# EAGLE design Core-ProMini (EAGLE 7.7.0)
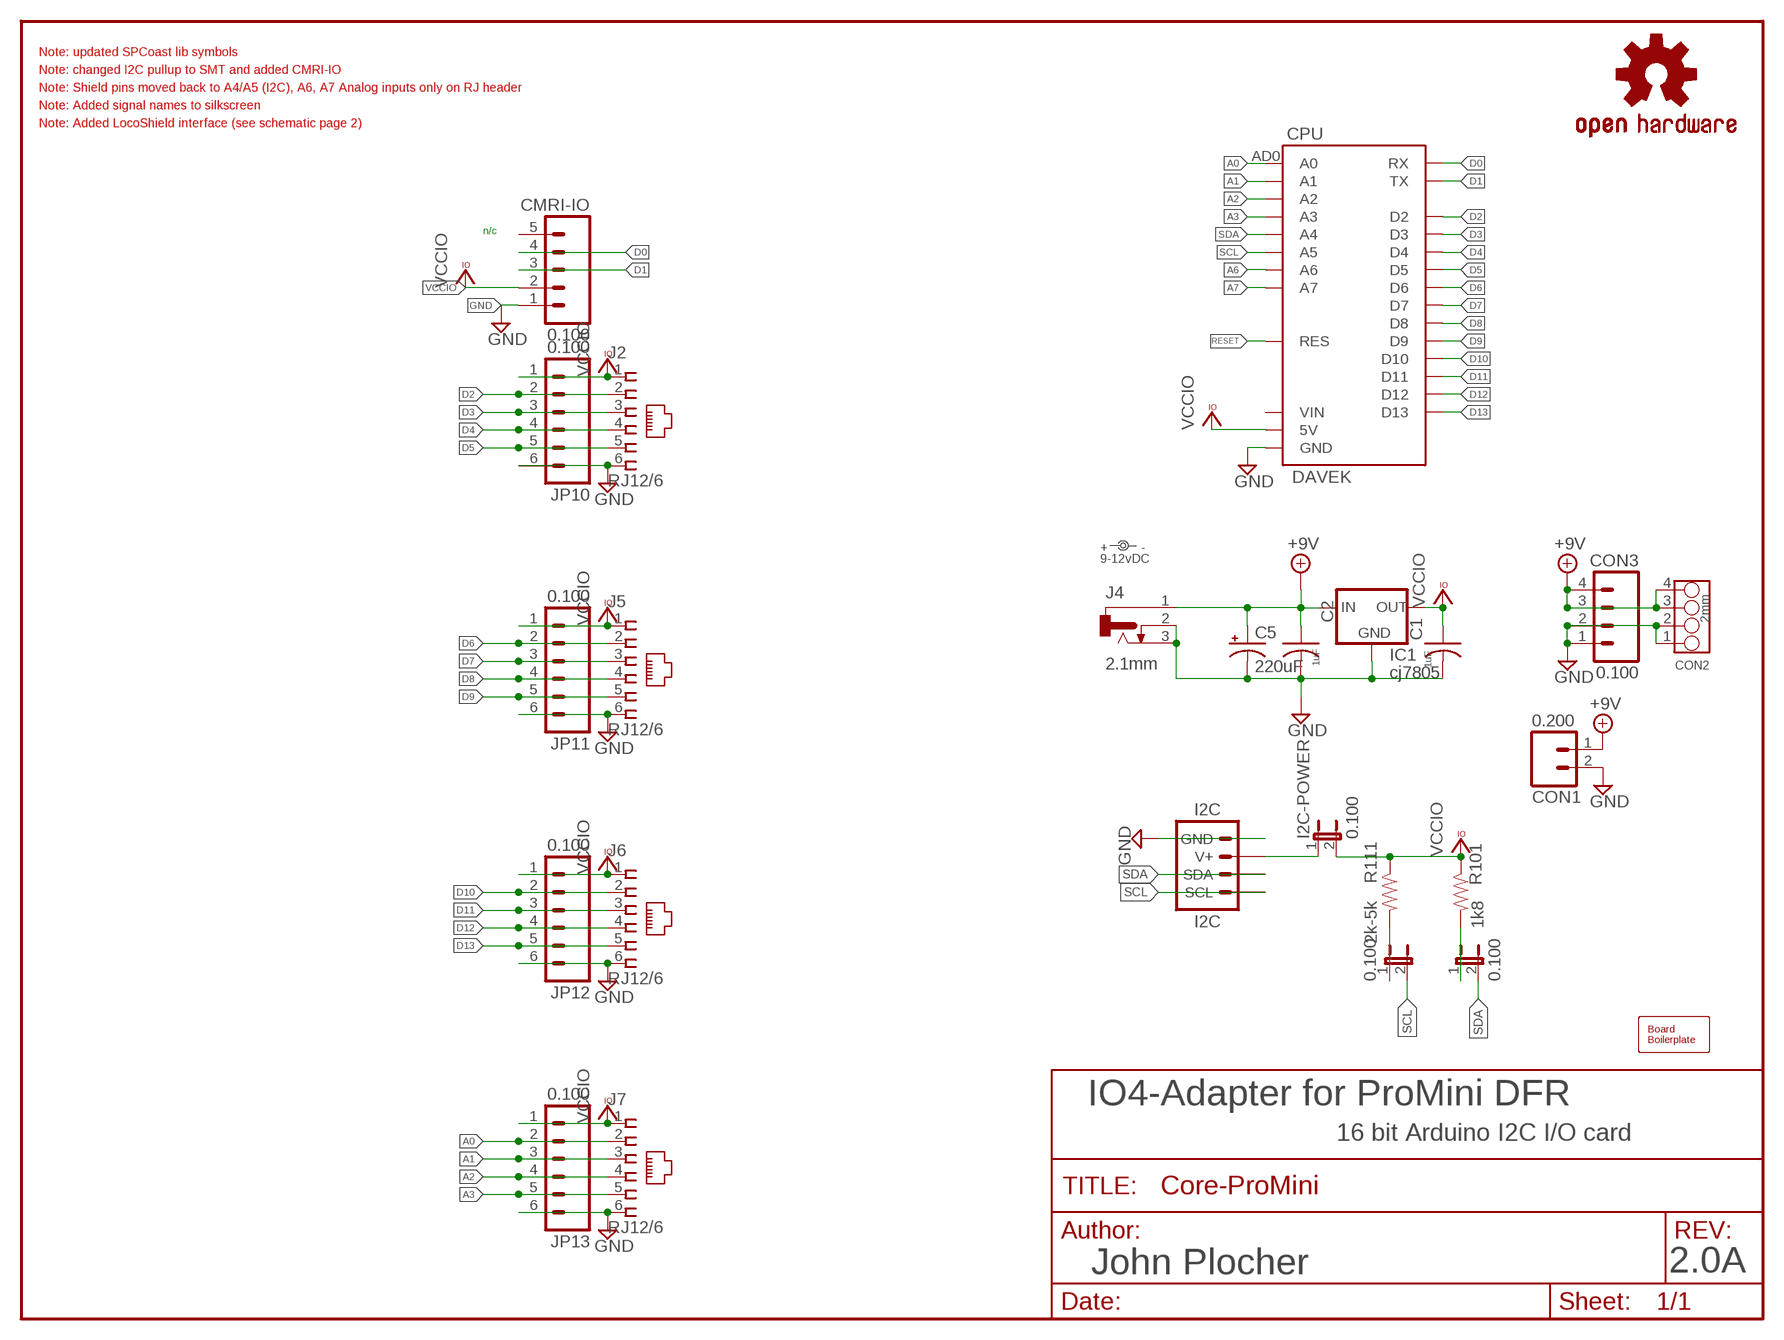
[diagram p0: schematic, sheet 1]

## Parts
BOARD  BOARD  BOARD80X100  [BOARD-DINRAIL-3.17INX10CM]
C1  1uF  CAP0603  [0603-CAP]
C2  1uF  CAP0603  [0603-CAP]
C5  220uF  CAP-POL0810  [0810-CAP]
CMRI-IO  0.100  CONNECTOR-M05CMRI  [1X05-CMRI-IO]
CON1  0.200  CONNECTOR-M02508-LOCK  [MSTB2]
CON2  2mm  CONNECTOR-GROVE-4P-2.0-3470130P1  [4P-2.0]
CON3  0.100  CONNECTOR-M04LOCK  [1X04_LOCK]
CPU  DAVEK  ARDUINO-PRO-MINIDAVESROBOT  [ARDUINO_PRO_MINI_DAVEK]
I2C  I2C  CONNECTOR-I2CLEFT  [I2C-L]
I2C-POWER  0.100  JUMPER-2PTH_LOCK  [1X02_LOCK]
IC1  cj7805  VREG-DPAK-5  [TO-252]
J2  RJ12/6  CONNECTOR-RJ25-6P6C  [RJ25-PANEL]
J4  2.1mm  CONNECTOR-DC-POWER-RA  [DCJ0202]
J5  RJ12/6  CONNECTOR-RJ25-6P6C  [RJ25-PANEL]
J6  RJ12/6  CONNECTOR-RJ25-6P6C  [RJ25-PANEL]
J7  RJ12/6  CONNECTOR-RJ25-6P6C  [RJ25-PANEL]
JP10  0.100  CONNECTOR-M06LOCK  [1X06_LOCK]
JP11  0.100  CONNECTOR-M06LOCK  [1X06_LOCK]
JP12  0.100  CONNECTOR-M06LOCK  [1X06_LOCK]
JP13  0.100  CONNECTOR-M06LOCK  [1X06_LOCK]
OSH  OSHW  OSHW-LOGOL  [OSHW-LOGO-L]
PWR  9-12vDC  DOC-POWER_LABEL  [PWR_LABEL]
R101  1k8  R0603-RES  [0603-RES]
R111  2k-5k  R0603-RES  [0603-RES]
SCL  0.100  JUMPER-2PTH_LOCK  [1X02_LOCK]
SDA  0.100  JUMPER-2PTH_LOCK  [1X02_LOCK]

## Nets
+9V [Power]: C2.1 C5.+ CON1.1(A) CON2.3 CON2.4 CON3.3 CON3.4 IC1.1(IN) J4.1
A0 [signals]: CPU.AD0(A0) J7.2 JP13.2
A1 [signals]: CPU.AD1(A1) J7.3 JP13.3
A2 [signals]: CPU.AD2(A2) J7.4 JP13.4
A3 [signals]: CPU.AD3(A3) J7.5 JP13.5
A6: CPU.AD6(A6)
A7: CPU.AD7(A7)
D0 [signals]: CMRI-IO.4 CPU.RX
D1 [signals]: CMRI-IO.3 CPU.TX@1(TX)
D2: CPU.D2 J2.2 JP10.2
D3: CPU.D3 J2.3 JP10.3
D4: CPU.D4 J2.4 JP10.4
D5 [signals]: CPU.D5 J2.5 JP10.5
D6 [signals]: CPU.D6 J5.2 JP11.2
D7: CPU.D7 J5.3 JP11.3
D8: CPU.D8 J5.4 JP11.4
D9 [signals]: CPU.D9 J5.5 JP11.5
D10 [signals]: CPU.D10 J6.2 JP12.2
D11 [signals]: CPU.D11 J6.3 JP12.3
D12 [signals]: CPU.D12 J6.4 JP12.4
D13 [signals]: CPU.D13 J6.5 JP12.5
GND [Power]: C1.2 C2.2 C5.- CMRI-IO.1 CON1.2(B) CON2.1 CON2.2 CON3.1 CON3.2 CPU.GND@1(GND) CPU.GND@2(GND) CPU.GND@4(GND) I2C.GND I2C.GND@1(GND) IC1.2(GND) J2.6 J4.2 J4.3 J5.6 J6.6 J7.6 JP10.6 JP11.6 JP12.6 JP13.6
N$2: R111.2 SCL.1
N$3: R101.2 SDA.1
N$44: I2C-POWER.1 I2C.V+ I2C.V+@1(V+)
RESET: CPU.RES CPU.RES@1(RES)
SCL: CPU.AD5(A5) I2C.SCL I2C.SCL@1(SCL) SCL.2
SDA: CPU.AD4(A4) I2C.SDA I2C.SDA@1(SDA) SDA.2
VCCIO: C1.1 CMRI-IO.2 CPU.5V I2C-POWER.2 IC1.3(OUT) J2.1 J5.1 J6.1 J7.1 JP10.1 JP11.1 JP12.1 JP13.1 R101.1 R111.1
Unconnected: CMRI-IO.5 CPU.VIN

## Notes on the sheet
- Note: updated SPCoast lib symbols
- Note: changed I2C pullup to SMT and added CMRI-IO
- Note: Shield pins moved back to A4/A5 (I2C), A6, A7 Analog inputs only on RJ header
- Note: Added signal names to silkscreen
- Note: Added LocoShield interface (see schematic page 2)
- n/c
- IO4-Adapter for ProMini DFR
- 16 bit Arduino I2C I/O card
- John Plocher | 2.0A

## Library data of the parts
BOARD = SPCoast:BOARD
C1 C2 = SPCoast:CAP*
C5 = SPCoast:CAP-POL*
CMRI-IO = SPCoast:CONNECTOR-M05: Header 5 Standard 5-pin 0.1" header. Use with straight break away headers (SKU : PRT-00116), right angle break away headers (PRT-00553), swiss pins (PRT-00743), machine pins (PRT-00117), and female headers (PRT-00115). Molex polarized connector foot print use with SKU : PRT-08230 with associated crimp pins and housings.
CON1 = SPCoast:CONNECTOR-M02: PHOENIX CONNECTOR
CON2 = SPCoast:CONNECTOR-GROVE-4P-2.0
CON3 = SPCoast:CONNECTOR-M04: Header 4 Standard 4-pin 0.1" header. Use with straight break away headers (SKU : PRT-00116), right angle break away headers (PRT-00553), swiss pins (PRT-00743), machine pins (PRT-00117), and female headers (PRT-00115). Molex polarized connector foot print use with SKU : PRT-08231 with associated crimp pins and housings. 1MM SMD Version SKU: PRT-10208
CPU = SPCoast:ARDUINO-PRO-MINI
I2C = SPCoast:CONNECTOR-I2C
I2C-POWER SCL SDA = SPCoast:JUMPER-2: Jumper Basic 0.1" spaced jumper. Use with breakaway headers.
IC1 = SPCoast:VREG-?-*: Voltage Regulator Standard linear regulator. 7805 uses IGO pinout LM1117 uses GOI pinout
J2 J5-J7 = SPCoast:CONNECTOR-RJ25: AMP connector; AMP: 520250-3; OPL: none
J4 = SPCoast:CONNECTOR-DC-POWER: DC POWER JACK
JP10-JP13 = SPCoast:CONNECTOR-M06: Header 6 Standard 6-pin 0.1" header
OSH = SparkFun:OSHW-LOGO: Open Source Hardware Logo This logo indicates the piece of hardware it is found on incorporates a OSHW license and/or adheres to the definition of open source hardware found here: http://freedomdefined.org/OSHW
PWR = SPCoast:DOC-POWER_LABEL
R101 R111 = SPCoast:R*: Resistor Basic schematic elements and footprints for 0603, 1206, and PTH 1/10th watt (small) resistors.

## Net classes
0 default: width 0.203 mm, drill 0.5 mm
1 Power: width 0.406 mm, drill 0.8 mm
2 signals: width 0.254 mm, drill 0.5 mm

## Board
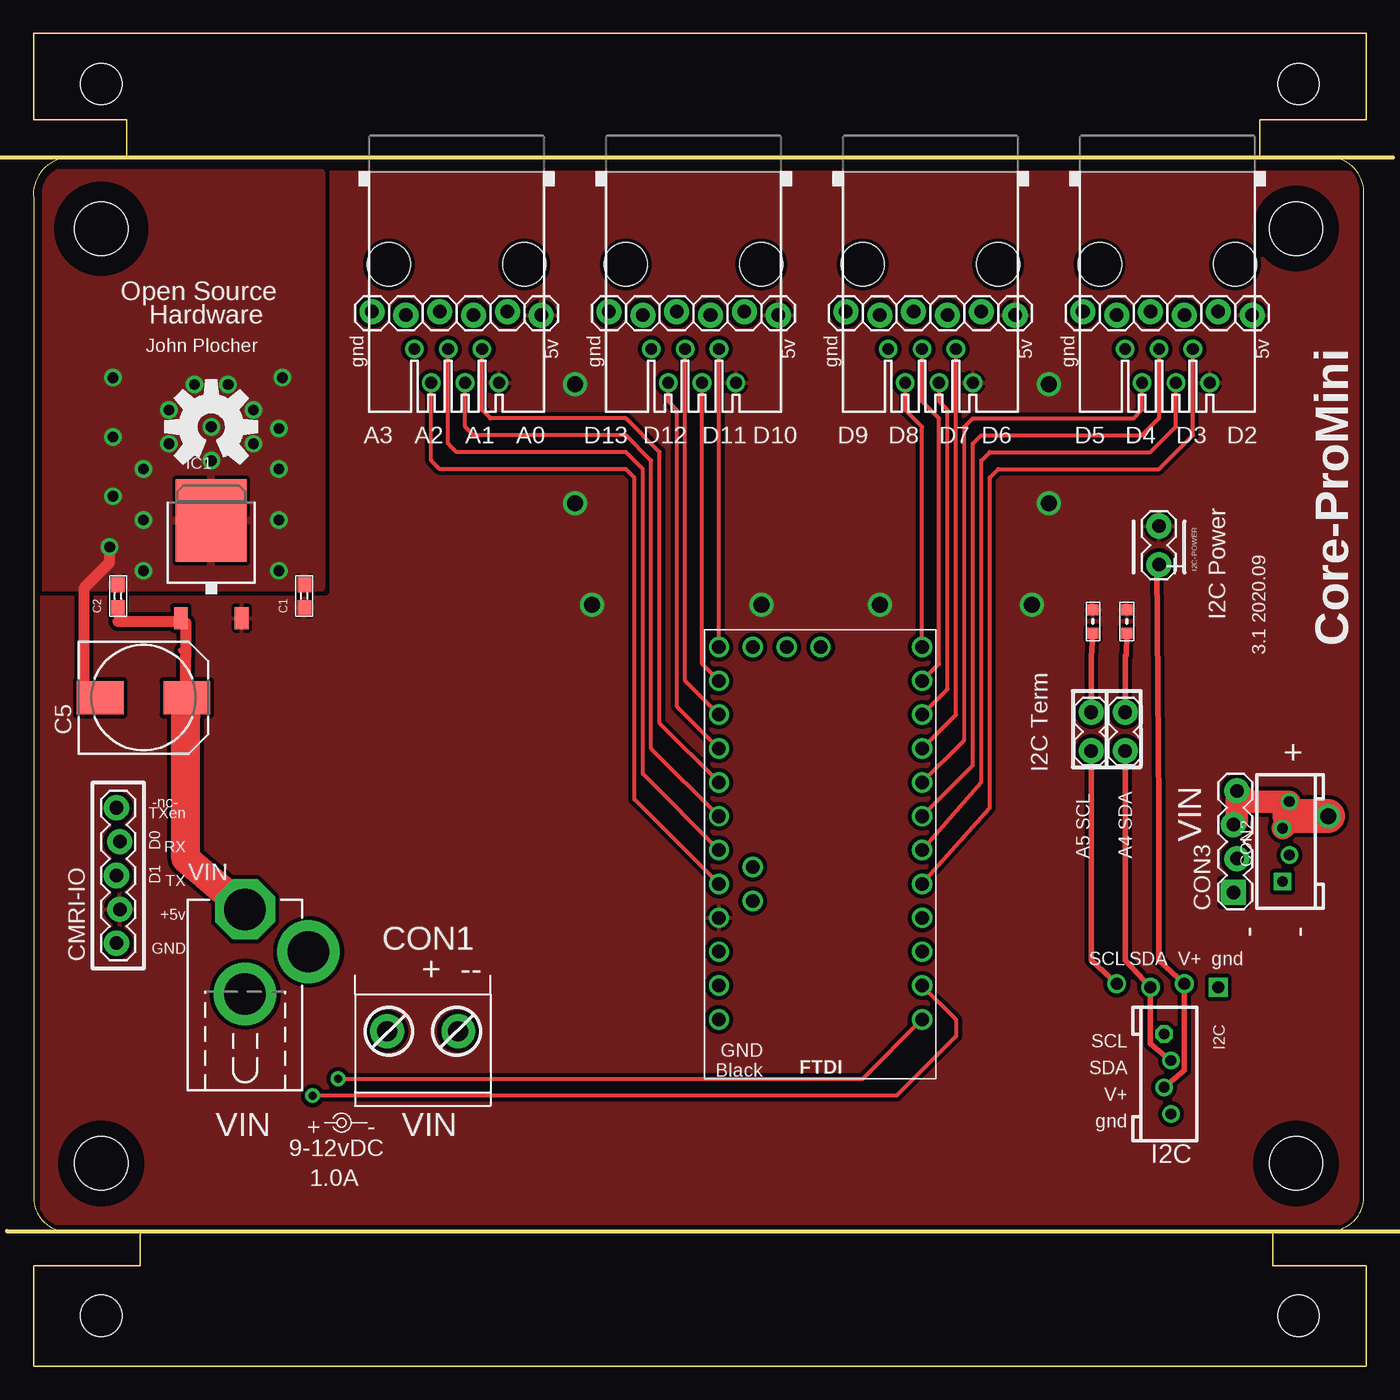
[diagram p1: board, top side]
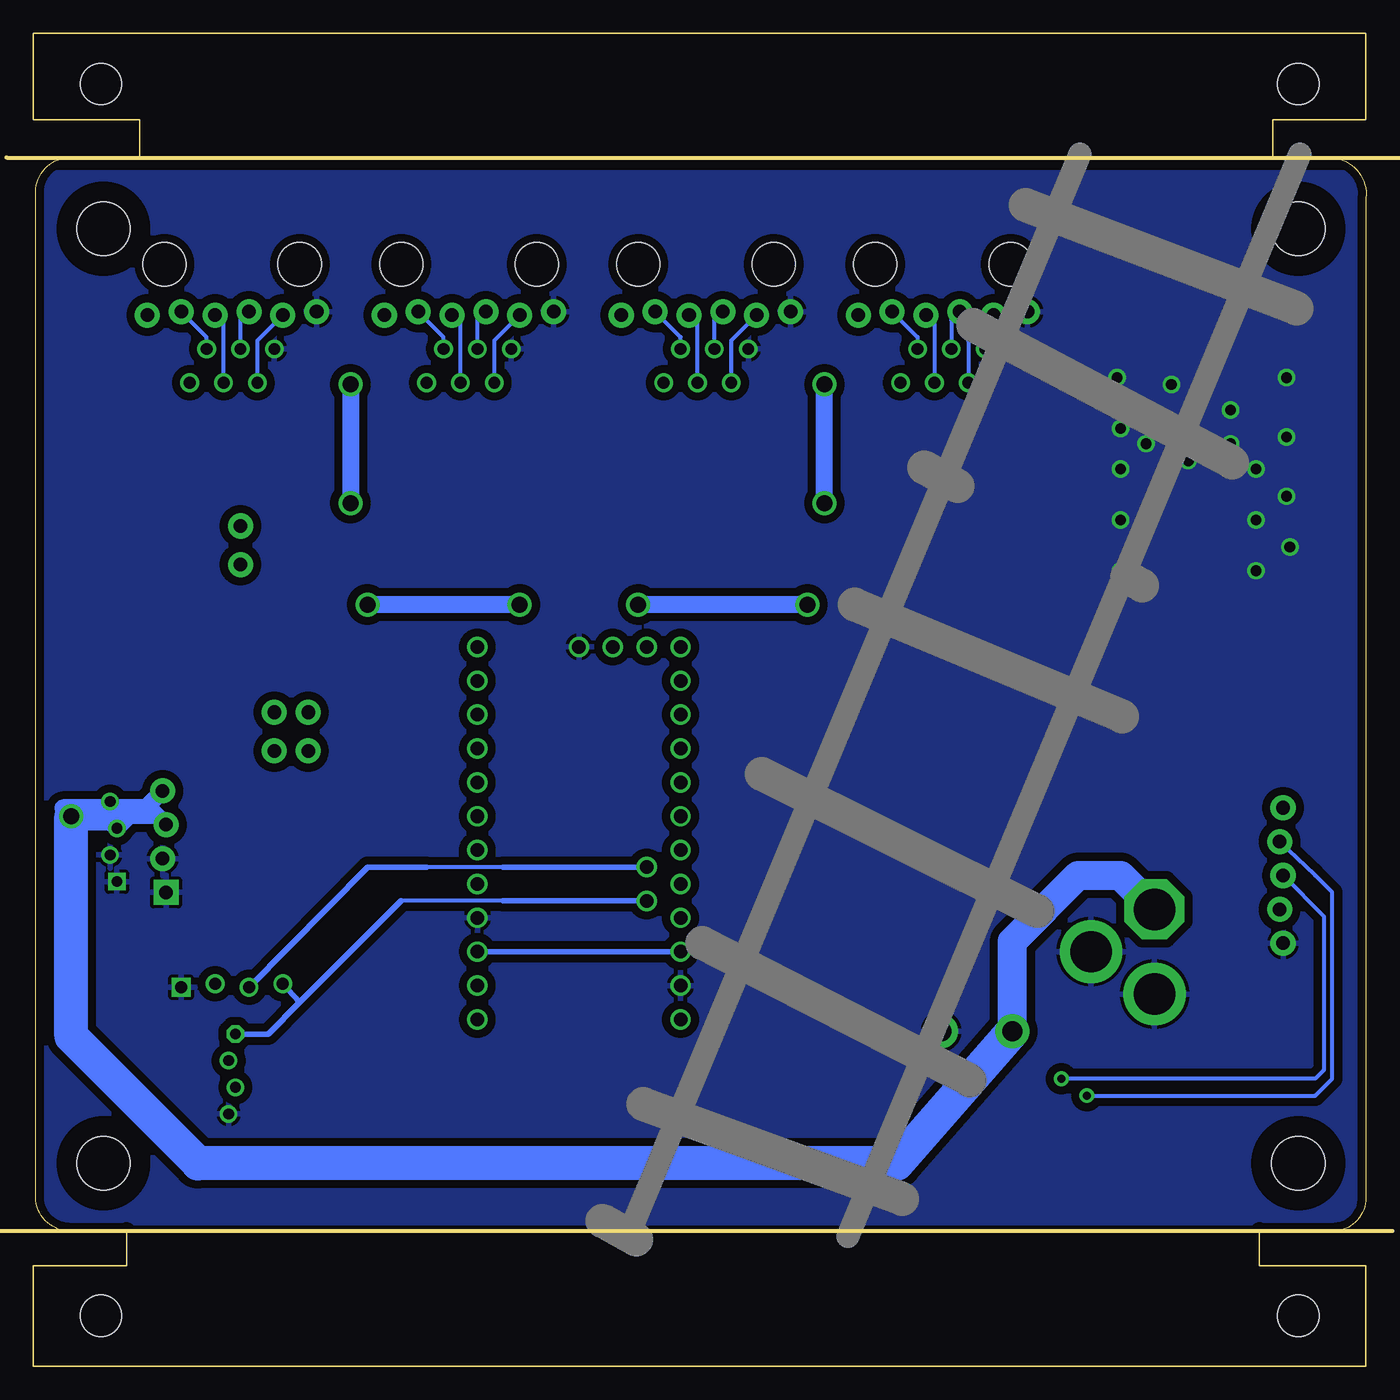
[diagram p2: board, bottom side, seen from below]

Size 100.01 x 100 mm. Coordinates in mm from the lower left corner, seen from the top.
Copper layers (1*16): Top 0.035mm / dielectric 1.5mm / Bottom 0.035mm
Design rules "Fusion_eagle_rule_v1.1 *": minimum track width 8mil, minimum drill 0.6mm, track to track 6mil, track to pad 6mil, pad to pad 10mil, via to via 10mil, smd to smd 10mil, copper to edge 10mil, drill to drill 10mil, minimum pad ring 10mil, minimum via ring 10mil, stop-mask expansion 2mil, vias tented up to drill 100mil, thermal gap 10mil

### Footprints (pad centres in the part's own frame; a part is rotated, then mirrored left to right if it is on the bottom)
BOARD-DINRAIL-3.17INX10CM = hole 4: 94.742,15.24; 5.08,85.344; 94.742,85.344; 5.08,15.24 | hole 3.1: 5.08,96.19; 94.92,96.19; 5.08,3.81; 94.92,3.81
0603-CAP = smd 1.1 x 1: 1 -0.85,0; 2 0.85,0
0810-CAP = smd 3.5 x 2.5: + 3.25,0; - -3.25,0
1X05-CMRI-IO = drill 1.016 pad 1.88: 1 0,0.127; 2 2.54,-0.127; 3 5.08,0.127; 4 7.62,-0.127; 5 10.16,0.127
MSTB2 = drill 1.5 pad 2.54: 1 -2.667,1.016; 2 2.667,1.016
4P-2.0 = drill 0.8 pad 1.27 square: 1 -3,0.254 | drill 0.8 pad 1.27: 2 -1,-0.254; 3 1,0.254; 4 3,-0.254
1X04_LOCK = drill 1.016 pad 1.88 square: 1 0,0.127 | drill 1.016 pad 1.88: 2 2.54,-0.127; 3 5.08,0.127; 4 7.62,-0.127
ARDUINO_PRO_MINI_DAVEK = drill 1.016: 5V 16.51,21.59; AD0 16.51,11.43; AD1 16.51,13.97; AD2 16.51,16.51; AD3 16.51,19.05; AD4 13.97,17.78; AD5 13.97,20.32; AD6 11.43,1.27; AD7 13.97,1.27; D2 1.27,19.05; D3 1.27,16.51; D4 1.27,13.97; D5 1.27,11.43; D6 1.27,8.89; D7 1.27,6.35; D8 1.27,3.81; D9 1.27,1.27; D10 16.51,1.27; D11 16.51,3.81; D12 16.51,6.35; D13 16.51,8.89; GND@1 16.51,26.67; GND@2 8.89,1.27; GND@4 1.27,21.59; RES 16.51,24.13; RES@1 1.27,24.13; RX 1.27,26.67; TX@1 1.27,29.21; VIN 16.51,29.21
I2C-L = drill 0.9 square: GND 3.81,-0.127 | drill 0.8 pad 1.27: GND@1 0.254,-9.635; SDA@1 0.254,-5.635; V+@1 -0.254,-7.635 | drill 0.9: SCL -3.81,0.127; SDA -1.27,-0.127; V+ 1.27,0.127 | drill 0.8 pad 1.27 octagon: SCL@1 -0.254,-3.635
1X02_LOCK = drill 1.016 pad 1.88: 1 -0.178,0; 2 2.718,0
TO-252 = smd 1.651 x 1.016: 1 -4.826,2.286; 3 -4.826,-2.286 | smd 6.2 x 5.3: 2 2.5,0
RJ25-PANEL = drill 0.889: 1 -3.175,8.89; 2 -1.905,6.35; 3 -0.635,8.89; 4 0.635,6.35; 5 1.905,8.89; 6 3.175,6.35 | hole 3.251: -5.08,0; 5.08,0
DCJ0202 = drill 3.1 pad 4.5 octagon: 1 0,3.175 | drill 3.1 pad 4.7: 2 4.763,0; 3 0,-3.175
1X06_LOCK = drill 1.016 pad 1.88: 1 0,0; 2 2.54,-0.254; 3 5.08,0; 4 7.62,-0.254; 5 10.16,0; 6 12.7,-0.254
0603-RES = smd 0.813 x 0.813: 1 -0.889,0; 2 0.889,0

### Placement (x,y rotation side)
BOARD  0.01,0 0 top
C1  20.33,57.78 90 top
C2  6.36,57.78 90 top
C5  8.27,50.16 0 top
CMRI-IO  6.36,31.75 90 top
CON1  29.22,24.13 0 top
CON2  93.99,39.37 90 top
CON3  90.18,35.56 90 top
CPU  67.96,55.24 180 top
I2C  85.1,28.57 0 top
I2C-POWER  84.47,60.33 90 top
IC1  13.35,60.96 90 top
J2  85.1,82.68 180 top
J4  15.89,31.11 0 top
J5  67.32,82.68 180 top
J6  49.54,82.68 180 top
J7  31.76,82.68 180 top
JP10  91.45,78.87 180 top
JP11  73.67,78.87 180 top
JP12  55.89,78.87 180 top
JP13  38.11,78.87 180 top
OSH  13.35,70.48 0 top
PWR  23.13,18.29 90 top
R101  82.06,55.88 270 top
R111  79.52,55.88 270 top
SCL  79.39,48.9 270 top
SDA  81.93,48.9 270 top

### Tracks (layer width: path | path; a pad name or v marks a point on that pad's centre or on a via)
+9V  (via drill 1.2)
  Top 0.406: 11.44,53.34 11.06,53.72 | C5.+ 11.44,48.82
  Top 0.61: IC1.1 10.81,55.88 | 6.36,55.88 C2.1
  Top 0.813: 11.44,48.82 11.44,53.34 11.44,55.75 IC1.1 | 10.81,55.88 6.36,55.88
  Top 1.676: CON3.3 90.31,40.89 CON3.4 91.12,42.37 CON2.4 94.25,41.27 94.25,40.88 CON2.3
  Top 2.184: 11.44,48.82 11.44,38.1 J4.1
  Top 2.54: v97.17,41.27 94.25,41.27
  Bottom 1.27: CON2.4 95.34,41.27 | 94.64,41.27 CON2.3 92.77,41.34 90.76,41.34 | CON3.4 91.58,41.91 97.8,41.91 | CON3.3 90.76,41.34 | 90.76,41.34 91.33,41.91 91.45,41.91
  Bottom 2.184: CON1.1 26.56,31.88 21.6,36.83 18.43,36.83 J4.1 | 95.34,41.27 v97.17,41.27 94.64,41.27
  Bottom 2.54: CON1.1 35.19,15.24 87.64,15.24 97.17,24.77 v97.17,41.27
A0
  Top 0.305: CPU.AD0 47,48.26 47,68.58 44.46,71.12 34.3,71.12 33.67,71.75 J7.2
  Bottom 0.305: JP13.2 33.67,77.22 J7.2
A1
  Top 0.305: CPU.AD1 46.37,46.35 46.37,67.94 44.46,69.85 33.03,69.85 32.4,70.48 J7.3
  Bottom 0.305: JP13.3 32.4,78.23 J7.3
A2
  Top 0.305: CPU.AD2 45.73,44.45 45.73,67.31 44.46,68.58 31.76,68.58 31.13,69.22 J7.4
  Bottom 0.305: JP13.4 31.13,78.49 J7.4
A3
  Top 0.305: CPU.AD3 45.1,42.55 45.1,66.67 44.46,67.31 30.49,67.31 29.86,67.94 J7.5
  Bottom 0.305: JP13.5 29.86,76.96 J7.5
D0  (via drill 0.6)
  Top 0.305: CPU.RX 69.23,26.04 69.23,24.77 64.78,20.32 v20.97,20.32
  Bottom 0.305: v20.97,20.32 3.82,20.32 2.55,21.59 2.55,35.56 3.82,36.83 CMRI-IO.4
D1  (via drill 0.6)
  Top 0.305: v22.87,21.59 62.24,21.59 CPU.TX@1
  Bottom 0.305: CMRI-IO.3 3.19,33.78 3.19,22.23 3.82,21.59 v22.87,21.59
D2
  Top 0.305: CPU.D2 71.77,41.91 71.77,66.67 72.4,67.31 84.47,67.31 87.01,69.85 J2.2
  Bottom 0.305: J2.2 87.01,77.22 JP10.2
D3
  Top 0.305: CPU.D3 71.13,43.81 71.13,67.94 71.77,68.58 83.83,68.58 85.74,70.48 J2.3
  Bottom 0.305: J2.3 85.74,78.23 JP10.3
D4
  Top 0.305: J2.4 84.47,71.12 83.2,69.85 71.13,69.85 70.5,69.22 70.5,45.09 CPU.D4
  Bottom 0.305: J2.4 84.47,78.49 JP10.4
D5
  Top 0.305: CPU.D5 69.86,46.99 69.86,70.48 70.5,71.12 82.56,71.12 83.2,71.75 J2.5
  Bottom 0.305: J2.5 83.2,76.96 JP10.5
D6
  Top 0.305: CPU.D6 69.23,48.9 J5.2
  Bottom 0.305: J5.2 69.23,77.22 JP11.2
D7
  Top 0.305: J5.3 67.96,72.39 68.59,71.75 68.59,50.8 CPU.D7
  Bottom 0.305: J5.3 67.96,78.23 JP11.3
D8
  Top 0.305: J5.4 66.69,72.39 67.96,71.12 67.96,52.7 CPU.D8
  Bottom 0.305: J5.4 66.69,78.49 JP11.4
D9
  Top 0.305: J5.5 65.42,71.75 66.69,70.48 CPU.D9
  Bottom 0.305: J5.5 65.42,76.96 JP11.5
D10
  Top 0.305: CPU.D10 J6.2
  Bottom 0.305: J6.2 51.45,77.22 JP12.2
D11
  Top 0.305: CPU.D11 50.18,52.7 J6.3
  Bottom 0.305: J6.3 50.18,78.23 JP12.3
D12
  Top 0.305: CPU.D12 48.91,51.44 J6.4
  Bottom 0.305: J6.4 48.91,78.49 JP12.4
D13
  Top 0.305: J6.5 47.64,72.39 48.27,71.75 48.27,49.53 CPU.D13
  Bottom 0.305: J6.5 47.64,76.96 JP12.5
GND  (via drill 0.8)
  Top 0.61: C5.- 5.09,50.24
  Top 0.813: 5.09,50.24 3.82,50.24 3.82,58.42 5.73,60.33 v5.73,61.47
  other vias: 18.43,59.69 18.43,63.5 18.43,67.31 8.27,59.69 8.27,63.5 8.27,67.31 13.35,67.94 16.52,71.75 10.17,71.75 12.08,73.66 5.98,65.28 5.98,74.17 18.68,74.17 5.98,69.72 18.43,70.36 14.62,73.66 10.17,69.22 16.52,69.22 13.35,70.48
  pour Bottom (isolate 0.61, rank 2): 99.58,10.79 99.58,89.53 0.65,89.53 0.65,10.79
  pour Top (isolate 0.61): 0.65,58.42 0.65,89.53 21.6,89.53 21.6,58.42
N$2
  Top 0.406: SCL.1 79.39,53.25 R111.2
N$3
  Top 0.406: SDA.1 81.93,53.34 82.02,53.34 R101.2
N$44
  Top 0.406: I2C.V+@1 86.37,22.21 I2C.V+ 84.47,30.48 84.47,41.91 84.29,60.15 I2C-POWER.1
RESET
  Bottom 0.406: CPU.RES@1 CPU.RES
SCL
  Top 0.406: I2C.SCL 79.39,30.48 SCL.2
  Bottom 0.305: 64.78,34.92 72.4,34.92
  Bottom 0.406: CPU.AD5 64.78,34.92 | 72.4,34.92 80.02,27.3 | 80.02,27.3 82.39,24.94 I2C.SCL@1 | I2C.SCL 80.02,27.3
SDA
  Top 0.406: SDA.2 81.93,30.48 I2C.SDA 83.83,24.21 I2C.SDA@1
  Bottom 0.305: 64.78,37.47 70.5,37.47
  Bottom 0.406: CPU.AD4 64.78,37.47 | 70.5,37.47 74.94,37.47 I2C.SDA
VCCIO  (via drill 1.2)
  Bottom 1.27: v40.65,64.77 v40.65,73.66 | v41.92,57.15 v54.62,57.15 | v76.21,73.66 v76.21,64.77 | v63.51,57.15 v74.94,57.15
  pour Top (isolate 0.305, rank 2): 99.58,10.79 99.58,89.53 0.65,89.53 0.65,10.79

### Text on the board
tPlace: Open Source | Hardware | John Plocher | 5v | 5v | 5v | 5v | gnd | gnd | gnd | gnd | A3 | A2 | A1 | A0 | D13 | D12 | D11 | D10 | D9 | D8 | D7 | D6 | D5 | D4 | D3 | D2 | + | I2C Power | Core-ProMini | 3.1 2020.09 | + | I2C Term | -nc- | D0 | VIN | VIN | A5 SCL | A4 SDA | D1 | - | - | + -- | VIN | VIN | 1.0A
tValues: 1k8
bDocu: For use with Pro Mini - DFRobot version | Made in the PCR, Coast Division, NMRA | ArdIOShield | IO4 breakout and I2C baseboard | Go Bears! | Model Railroading is fun! | LocoShield | www. SP Coast .com